# Altium project Negatoscop.PrjPcb
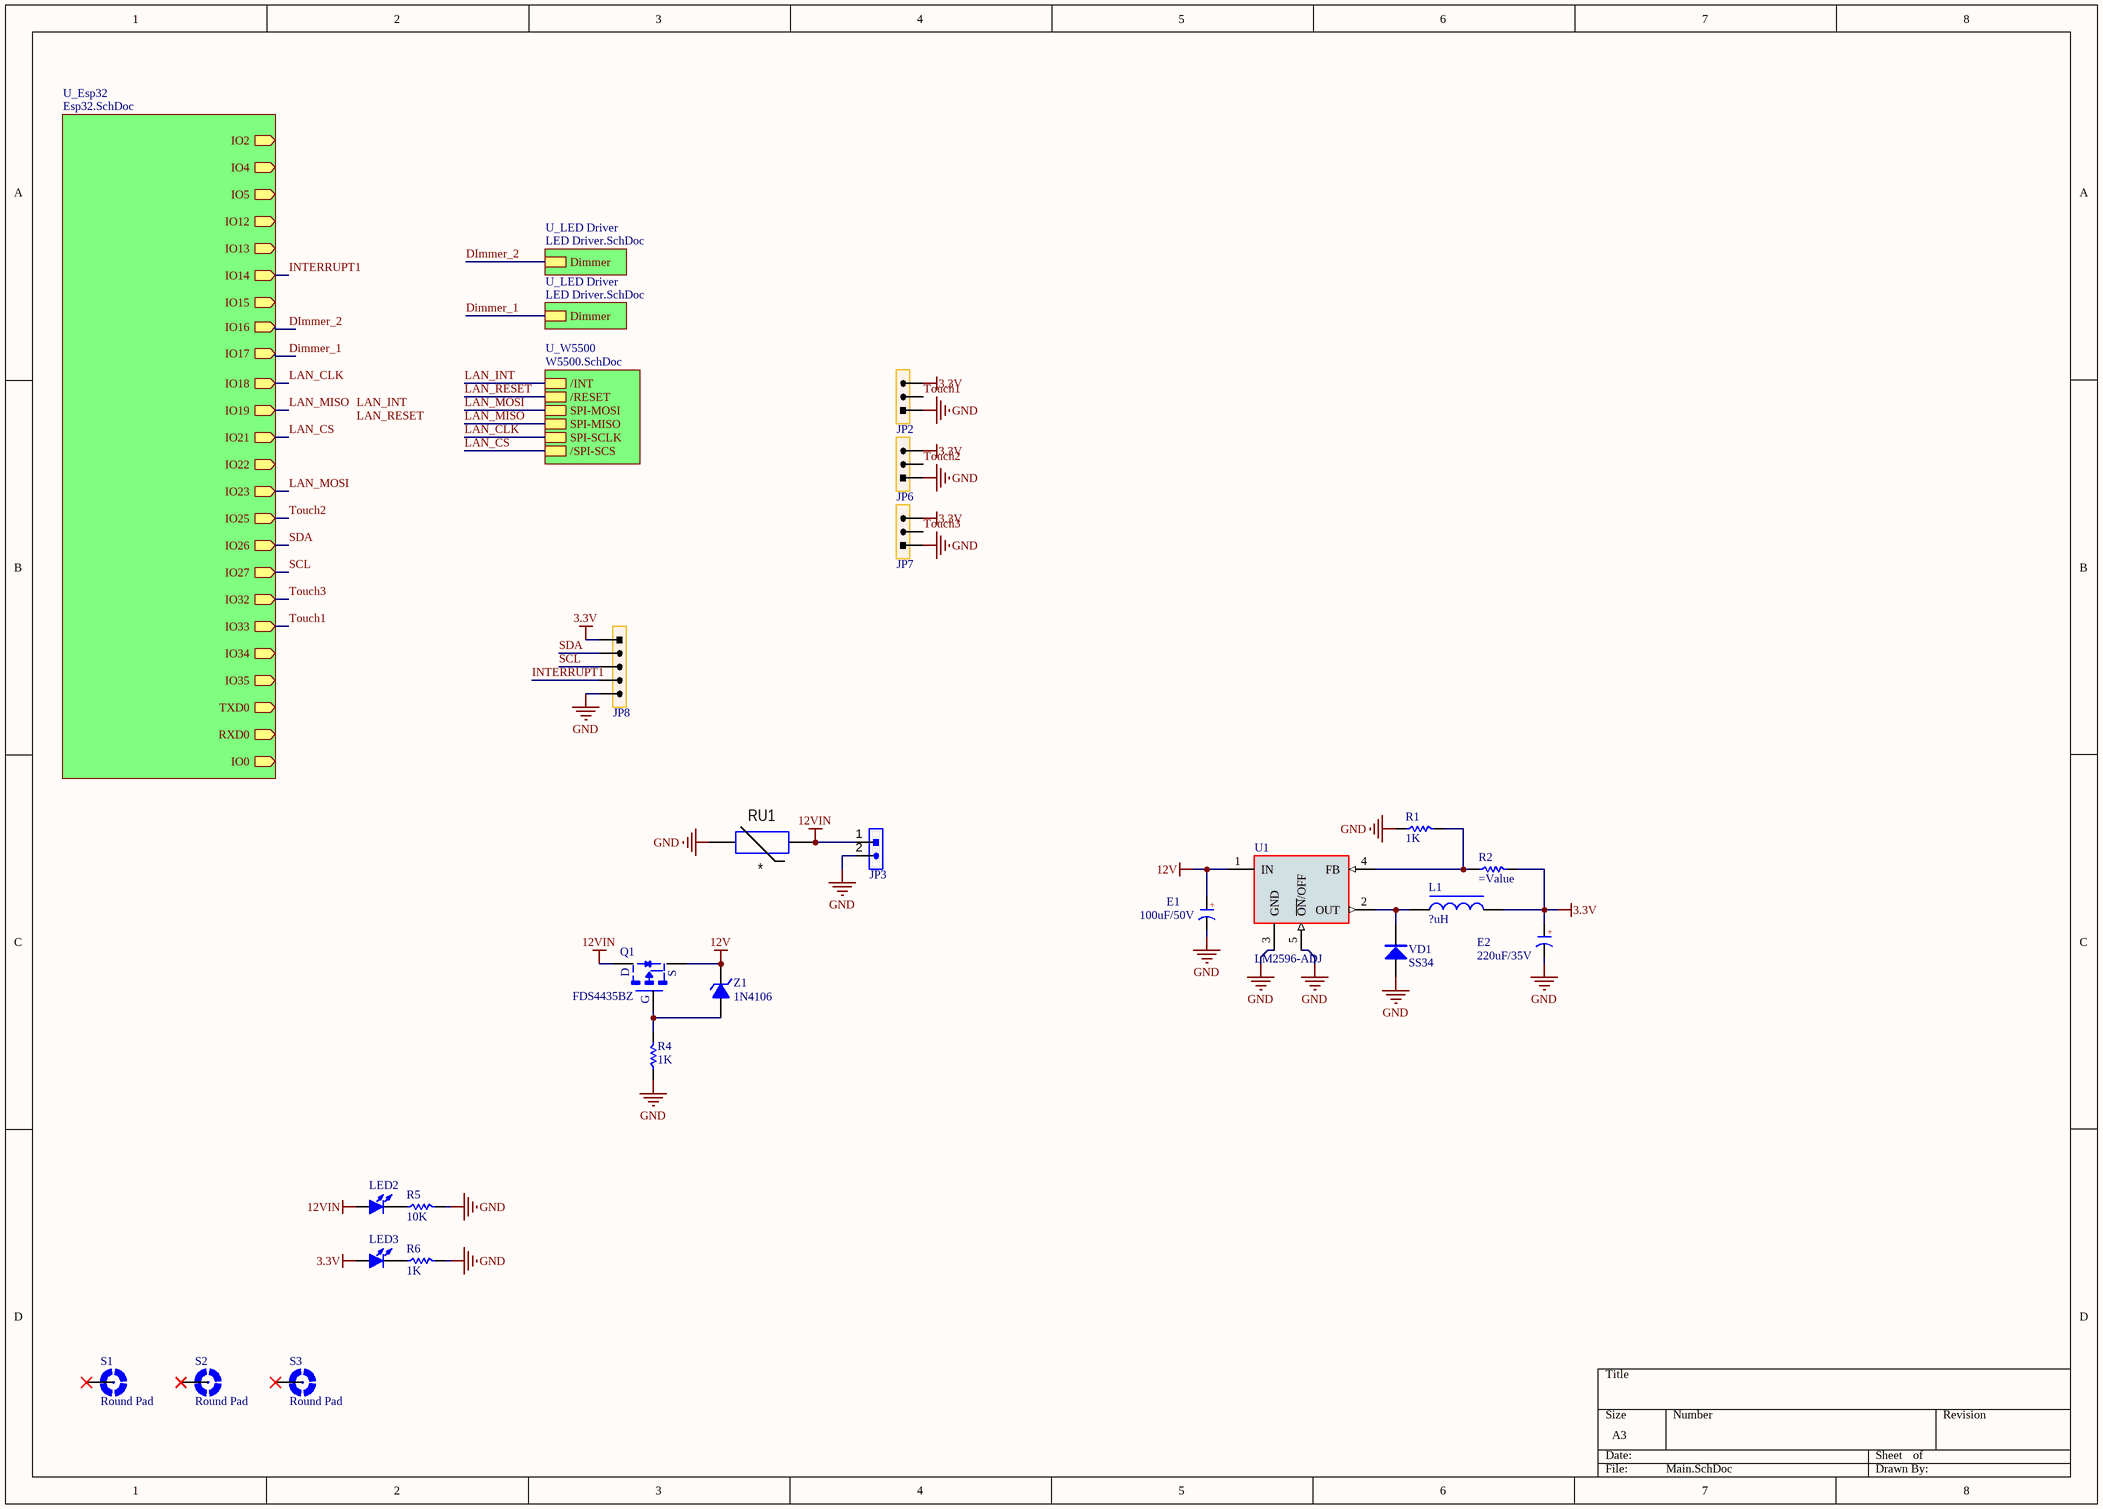
[diagram p0: Main.SchDoc]
4 sheets, 92 parts. Net scope: hierarchical (ports join the sheet entries above them; power ports are global).
Board file: Negatoscop PCB.PcbDoc
Sheets:
  Main.SchDoc
    U_Esp32 = Esp32.SchDoc
    U_LED Driver = LED Driver.SchDoc
    U_LED Driver = LED Driver.SchDoc
    U_W5500 = W5500.SchDoc

## Sheet Main.SchDoc
size A3; SheetNumber: 1; SheetTotal: 4

### Parts
(Parts that share a designator on the sheet are numbered #1, #2 ... from top to bottom, then left to right.)
E1  100uF/50V  [CM E(8*10.2)]
E2  220uF/35V  [CM E(8*10.2)]
JP2  HDR-1X3  [XH2.54-3P_H]  (value not drawn)
JP3  HDR-1X2  [KF2EDGK-2P_H_7.62]  (value not drawn)
JP6  HDR-1X3  [XH2.54-3P_H]  (value not drawn)
JP7  HDR-1X3  [XH2.54-3P_H]  (value not drawn)
JP8#1  HDR-1X5  [XH2.54-5P_H]  (value not drawn)
L1  ?uH  [CDRH125]
LED2  LED-SMD  [LED 0805R]  (value not drawn)
LED3  LED-SMD  [LED 0805R]  (value not drawn)
Q1  FDS4435BZ  [SOP8-E3]
R1  1K  [R 0805]
R2  (no value)  [R 0805]
R4  1K  [R 0805]
R5  10K  [R 0805]
R6  1K  [R 0805]
RU1  *  [Varistor Short Hieght - Straight]
S1  Round Pad  [P3.0C]  (no BOM)
S2  Round Pad  [P3.0C]  (no BOM)
S3  Round Pad  [P3.0C]  (no BOM)
U1  LM2596-ADJ  [TO263-5A]
VD1  SS34  [SMA]
Z1  1N4106  [DO-213AA]

### Sub-sheets
U_Esp32 = Esp32.SchDoc: IO2 (out), IO4 (out), IO5 (out), IO12 (out), IO13 (out), IO14 (out), IO15 (out), IO16 (out), IO17 (out), IO18 (out), IO19 (out), IO21 (out), IO22 (out), IO23 (out), IO25 (out), IO26 (out), IO27 (out), IO32 (out), IO33 (out), IO34 (out), IO35 (out), TXD0 (out), RXD0 (out), IO0 (out)
U_LED Driver = LED Driver.SchDoc: Dimmer
U_LED Driver = LED Driver.SchDoc: Dimmer
U_W5500 = W5500.SchDoc: /INT, /RESET, SPI-MOSI, SPI-MISO, SPI-SCLK, /SPI-SCS

### Nets
3.3V: E2.1(A) JP2.3 JP6.3 JP7.3 JP8#1.1 L1.2 LED3.1(A) R2.2
12V: E1.1(A) Q1.1-3(S) U1.1(IN) Z1.2(K)
12VIN: JP3.1 LED2.1(A) Q1.5-8(D) RU1.2
GND: E1.2(K) E2.2(K) JP2.1 JP3.2 JP6.1 JP7.1 JP8#1.5 R1.1 R4.1 R5.2 R6.2 RU1.1 U1.3(GND) U1.5(~{ON}/OFF) VD1.1(A)
SHIELD: S1.P S2.P S3.P
Dimmer_1: sheet U_Esp32/IO17, sheet U_LED Driver/Dimmer
DImmer_2: sheet U_Esp32/IO16, sheet U_LED Driver/Dimmer
INTERRUPT1: JP8#1.4 ; sheet U_Esp32/IO14
LAN_CLK: sheet U_Esp32/IO18, sheet U_W5500/SPI-SCLK
LAN_CS: sheet U_Esp32/IO21, sheet U_W5500//SPI-SCS
LAN_MISO: sheet U_Esp32/IO19, sheet U_W5500/SPI-MISO
LAN_MOSI: sheet U_Esp32/IO23, sheet U_W5500/SPI-MOSI
SCL: JP8#1.3 ; sheet U_Esp32/IO27
SDA: JP8#1.2 ; sheet U_Esp32/IO26
Touch1: JP2.2 ; sheet U_Esp32/IO33
Touch2: JP6.2 ; sheet U_Esp32/IO25
Touch3: JP7.2 ; sheet U_Esp32/IO32
NetL1_1: L1.1 U1.2(OUT) VD1.2(K)
NetLED2_2: LED2.2(K) R5.1
NetLED3_2: LED3.2(K) R6.1
NetQ1_4: Q1.4(G) R4.2 Z1.1(A)
NetR1_2: R1.2 R2.1 U1.4(FB)

### Notes on the sheet
- Labels drawn without touching a wire or pin: LAN_INT, LAN_RESET
- (in symbol C-CM) +

### Library data of the parts
E1 E2 = C-CM: Chip electrolytic capacitor; BOM名称: 贴片电解电容; 版权归属: 源创客; 学习资源: www.ooocke.com
JP2 JP6 JP7 = Header 3: 3P Connector; BOM名称: 3P接插件; 版权归属: 源创客; 学习资源: www.ooocke.com
JP3 = Header 2: 2P Connector; BOM名称: 2P接插件; 版权归属: 源创客; 学习资源: www.ooocke.com
JP8#1 = Header 5: 5P Connector; BOM名称: 5P接插件; 版权归属: 源创客; 学习资源: www.ooocke.com
L1 = L-CDRH: Power shielded inductor; BOM名称: 功率屏蔽电感; 版权归属: 源创客; 学习资源: www.ooocke.com
LED2 LED3 = LED-SMD: Patch LED; BOM名称: 贴片LED; 版权归属: 源创客; 学习资源: www.ooocke.com
R1 R2 R4-R6 = R: Chip resistor; 版权归属: 源创客; BOM名称: Chip resistor; 学习资源: www.ooocke.com
RU1 = V: Versiror; Manufacturer: *; Model: *; HelpURL: *; ComponentKind: *; Value: *
S1-S3 = MOUNT-PAD-ROUND: MOUNTING PAD, round
U1 = LM2596: DC step-down chip; BOM名称: DC稳压芯片; 版权归属: 源创客; 学习资源: www.ooocke.com
VD1 = SS34: Schottky diodes; BOM名称: 肖特基二极管; 版权归属: 源创客; 属性: 40V/3A; 学习资源: www.ooocke.com
Z1 = 1N4106: 12V/0.5W voltage regulator; BOM名称: 12V/0.5W稳压管; 版权归属: 源创客; 学习资源: www.ooocke.com

## Sheet Esp32.SchDoc
size A; SheetNumber: 2; SheetTotal: 4
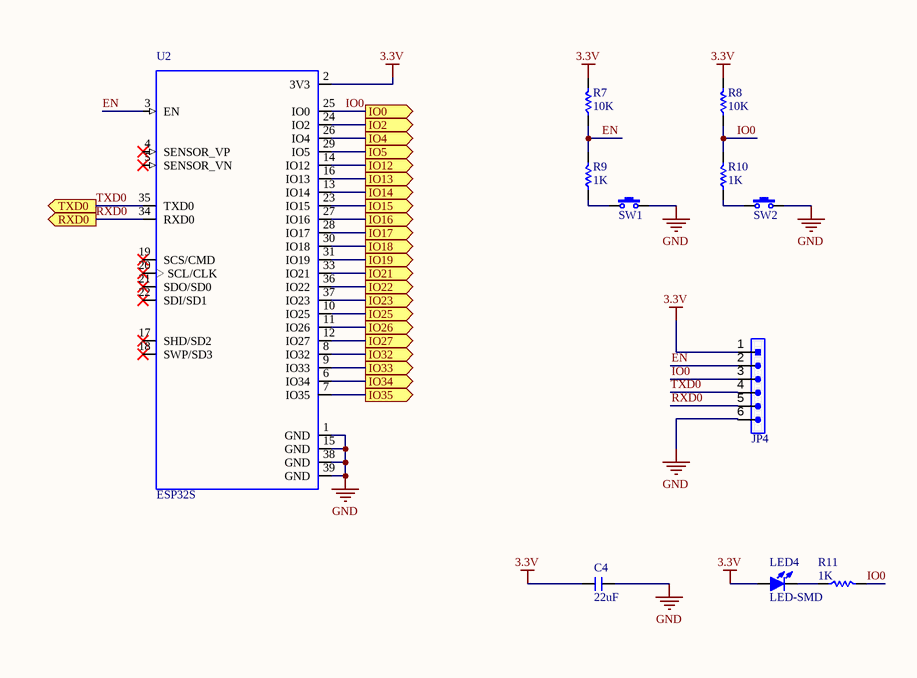
[diagram p1: Esp32.SchDoc]

### Parts
(Parts that share a designator on the sheet are numbered #1, #2 ... from top to bottom, then left to right.)
C4#1  22uF  [C 0805]
JP4  HDR-1X6  [HDR-1X6]  (value not drawn)
LED4  LED-SMD  [LED 0805B]
R7  10K  [R 0805]
R8  10K  [R 0805]
R9  1K  [R 0805]
R10  1K  [R 0805]
R11  1K  [R 0805]
SW1  3x6x5  [TSW SMD-3*6*2.5]  (value not drawn)
SW2  3x6x5  [TSW SMD-3*6*2.5]  (value not drawn)
U2  ESP32S  [ESP32S]

### Ports
IO0 (out), IO2 (out), IO4 (out), IO5 (out), IO12 (out), IO13 (out), IO14 (out), IO15 (out), IO16 (out), IO17 (out), IO18 (out), IO19 (out), IO21 (out), IO22 (out), IO23 (out), IO25 (out), IO26 (out), IO27 (out), IO32 (out), IO33 (out), IO34 (out), IO35 (out), RXD0 (out), TXD0 (out)

### Nets
3.3V: C4#1.1 JP4.1 LED4.1(A) R7.2 R8.2 U2.2(3V3)
GND: C4#1.2 JP4.6 SW1.2 SW2.2 U2.1(GND) U2.15(GND) U2.38(GND) U2.39(GND)
Dimmer_1: U2.28(IO17) ; port IO17
DImmer_2: U2.27(IO16) ; port IO16
EN: JP4.2 R7.1 R9.2 U2.3(EN)
INTERRUPT1: U2.13(IO14) ; port IO14
IO0: JP4.3 R8.1 R10.2 R11.2 U2.25(IO0) ; port IO0
LAN_CLK: U2.30(IO18) ; port IO18
LAN_CS: U2.33(IO21) ; port IO21
LAN_MISO: U2.31(IO19) ; port IO19
LAN_MOSI: U2.37(IO23) ; port IO23
RXD0: JP4.5 U2.34(RXD0) ; port RXD0
SCL: U2.12(IO27) ; port IO27
SDA: U2.11(IO26) ; port IO26
Touch1: U2.9(IO33) ; port IO33
Touch2: U2.10(IO25) ; port IO25
Touch3: U2.8(IO32) ; port IO32
TXD0: JP4.4 U2.35(TXD0) ; port TXD0
NetLED4_2: LED4.2(K) R11.1
NetR9_1: R9.1 SW1.1
NetR10_1: R10.1 SW2.1
NetU2_6: U2.6(IO34) ; port IO34
NetU2_7: U2.7(IO35) ; port IO35
NetU2_14: U2.14(IO12) ; port IO12
NetU2_16: U2.16(IO13) ; port IO13
NetU2_23: U2.23(IO15) ; port IO15
NetU2_24: U2.24(IO2) ; port IO2
NetU2_26: U2.26(IO4) ; port IO4
NetU2_29: U2.29(IO5) ; port IO5
NetU2_36: U2.36(IO22) ; port IO22

Not connected (* = marked no-connect by the designer): U2 4(SENSOR_VP)* 5(SENSOR_VN)* 17(SHD/SD2)* 18(SWP/SD3)* 19(SCS/CMD)* 20(SCL/CLK)* 21(SDO/SD0)* 22(SDI/SD1)*

### Library data of the parts
C4#1 = C: Non-polar patch capacitor; BOM名称: 无极性贴片电容; 版权归属: 源创客; 学习资源: www.ooocke.com
JP4 = Header 6: 6P Connector; BOM名称: 6P接插件; 版权归属: 源创客; 学习资源: www.ooocke.com
LED4 = LED-SMD: Patch LED; BOM名称: 贴片LED; 版权归属: 源创客; 学习资源: www.ooocke.com
R7-R11 = R: Chip resistor; 版权归属: 源创客; BOM名称: Chip resistor; 学习资源: www.ooocke.com
SW1 SW2 = TSW 3x6: 3x6 tact switch; BOM名称: 3x6轻触开关; 版权归属: 源创客; 学习资源: www.ooocke.com
U2 = ESP32S: MP: ESP32-WROOM-32D; MF: Espressif Systems; Package: Module Espressif Systems; Price: None; Availability: Unavailable; SnapEDA_Link: https://www.snapeda.com/parts/ESP32-WROOM-32D/Espressif%20Systems/view-part/?ref=snap; Value: *

## Sheet LED Driver.SchDoc
size A; SheetNumber: 4; SheetTotal: 4
Used 2 times, as channels U_LED Driver, U_LED Driver. Parts and nets are listed once, with the designators drawn on the sheet.
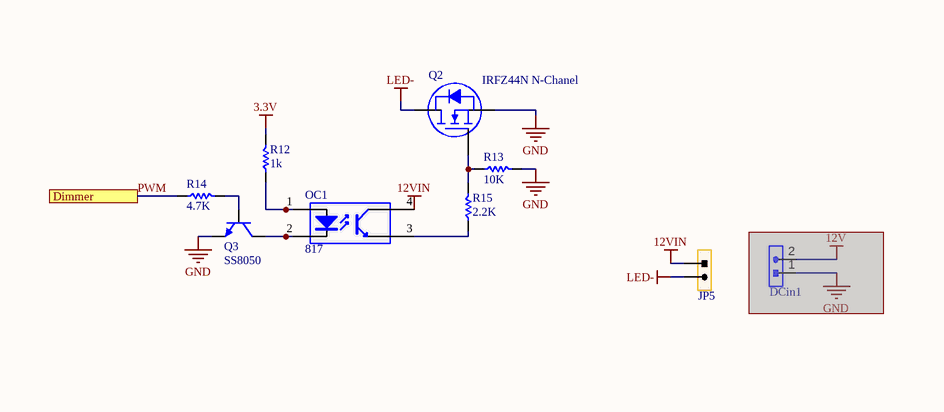
[diagram p2: LED Driver.SchDoc]

### Parts
DCin1  HDR-1X2  [KF2EDGK-2P_5.08]  (value not drawn)  (masked out: inside a compile mask, not in the netlist)
JP5  HDR-1X2  [KF381GR-2]  (value not drawn)
OC1  817  [PC817-SMD]
Q2  IRFZ44N N-Chanel  [TO263-3B]
Q3  SS8050  [SOT23-3N]
R12  1k  [R 0805]
R13  10K  [R 0805]
R14  4.7K  [R 0805]
R15  2.2K  [R 0805]

### Ports
Dimmer

### Nets
3.3V: R12.2
12VIN: JP5.1 OC1.4(C)
GND: Q2.3(S) Q3.2(E) R13.2
LED-: JP5.2 Q2.2(D)
PWM: R14.1 ; port Dimmer
NetOC1_1: OC1.1(A) R12.1
NetOC1_2: OC1.2(K) Q3.3(C)
NetOC1_3: OC1.3(E) R15.1
NetQ2_1: Q2.1(G) R13.1 R15.2
NetQ3_1: Q3.1(B) R14.2

### Channels
U_LED Driver: designators end in _U_LED_Driver#1; ports Dimmer=DImmer_2
U_LED Driver: designators end in _U_LED_Driver#2; ports Dimmer=Dimmer_1

### Library data of the parts
DCin1 JP5 = Header 2: 2P Connector; BOM名称: 2P接插件; 版权归属: 源创客; 学习资源: www.ooocke.com
OC1 = 817: AC Input Photocoupler; BOM名称: 线性光耦; 版权归属: 源创客; 学习资源: www.ooocke.com
Q2 = IRFZ44N
Q3 = 8050-SMD: High frequency amplification-NPN; BOM名称: 高频放大-NPN型; 版权归属: 源创客; 属性: 40V 1.5A 1W 100MHZ; 学习资源: www.ooocke.com
R12-R15 = R: Chip resistor; 版权归属: 源创客; BOM名称: Chip resistor; 学习资源: www.ooocke.com

## Sheet W5500.SchDoc
size A4; SheetNumber: 3; SheetTotal: 4
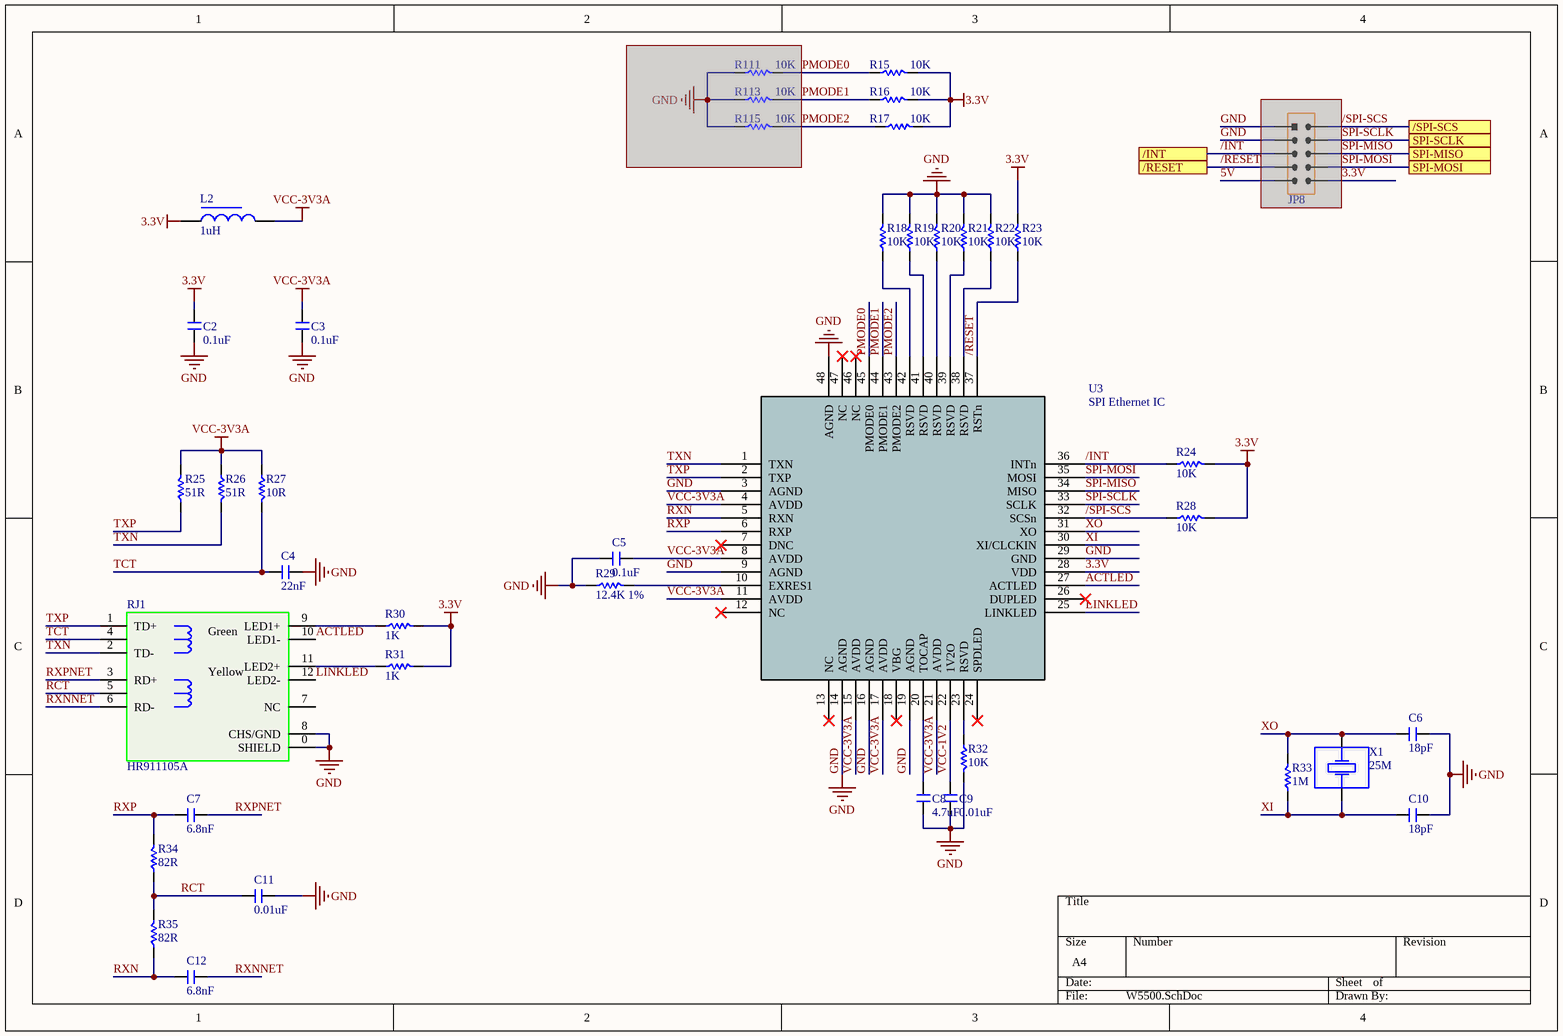
[diagram p3: W5500.SchDoc]

### Parts
(Parts that share a designator on the sheet are numbered #1, #2 ... from top to bottom, then left to right.)
C2  0.1uF  [C 0805]
C3  0.1uF  [C 0805]
C4#2  22nF  [C 0805]
C5  0.1uF  [C 0805]
C6  18pF  [C 0805]
C7  6.8nF  [C 0805]
C8  4.7uF  [C 0805]
C9  0.01uF  [C 0805]
C10  18pF  [C 0805]
C11  0.01uF  [C 0805]
C12  6.8nF  [C 0805]
JP8#2  Header 5X2  [HDR-5X2]  (value not drawn)  (masked out: inside a compile mask, not in the netlist)
L2  1uH  [L 0805]
R15  10K  [R 0805]
R16  10K  [R 0805]
R17  10K  [R 0805]
R18  10K  [R 0805]
R19  10K  [R 0805]
R20  10K  [R 0805]
R21  10K  [R 0805]
R22  10K  [R 0805]
R23  10K  [R 0805]
R24  10K  [R 0805]
R25  51R  [R 0805]
R26  51R  [R 0805]
R27  10R  [R 0805]
R28  10K  [R 0805]
R29  12.4K 1%  [R 0805]
R30  1K  [R 0805]
R31  1K  [R 0805]
R32  10K  [R 0805]
R33  1M  [R 0805]
R34  82R  [R 0805]
R35  82R  [R 0805]
R111  10K  [R 0805]  (masked out: inside a compile mask, not in the netlist)
R113  10K  [R 0805]  (masked out: inside a compile mask, not in the netlist)
R115  10K  [R 0805]  (masked out: inside a compile mask, not in the netlist)
RJ1  HR911105A  [RJ-45A12]
U3  SPI Ethernet IC  [LQFP48 7X7_L]
X1  25M  [XTAL-HC49S-THD]

### Ports
/INT, /RESET, /SPI-SCS, SPI-MISO, SPI-MOSI, SPI-SCLK

### Nets
3.3V: C2.2 L2.1 R15.2 R16.2 R17.2 R23.2 R24.2 R28.2 R30.2 R31.2 U3.28(VDD)
GND: C2.1 C3.1 C4#2.2 C5.1 C6.2 C8.2 C9.2 C10.2 C11.2 R18.2 R19.2 R20.2 R21.2 R22.2 R29.1 R32.2 RJ1.0(SHIELD) RJ1.8(CHS/GND) U3.3(AGND) U3.9(AGND) U3.14(AGND) U3.16(AGND) U3.19(AGND) U3.29(GND) U3.48(AGND)
VCC-3V3A: C3.2 C5.2 L2.2 R25.2 R26.1 R27.1 U3.4(AVDD) U3.8(AVDD) U3.11(AVDD) U3.15(AVDD) U3.17(AVDD) U3.21(AVDD)
/INT: R24.1 U3.36(INTn) ; port /INT
/RESET: R23.1 U3.37(RSTn) ; port /RESET
/SPI-SCS: R28.1 U3.32(SCSn)
ACTLED: RJ1.10(LED1-) U3.27(ACTLED)
LINKLED: RJ1.12(LED2-) U3.25(LINKLED)
PMODE0: U3.45(PMODE0)
PMODE1: U3.44(PMODE1)
PMODE2: U3.43(PMODE2)
RCT: C11.1 R34.1 R35.2 RJ1.5
RXN: C12.1 R35.1 U3.5(RXN)
RXNNET: C12.2 RJ1.6(RD-)
RXP: C7.1 R34.2 U3.6(RXP)
RXPNET: C7.2 RJ1.3(RD+)
SPI-MISO: U3.34(MISO)
SPI-MOSI: U3.35(MOSI)
SPI-SCLK: U3.33(SCLK)
TCT: C4#2.1 R27.2 RJ1.4
TXN: R26.2 RJ1.2(TD-) U3.1(TXN)
TXP: R25.1 RJ1.1(TD+) U3.2(TXP)
VCC-1V2: C9.1 U3.22(1V2O)
XI: C10.1 R33.1 U3.30(XI/CLCKIN) X1.1
XO: C6.1 R33.2 U3.31(XO) X1.2
NetC8_1: C8.1 U3.20(TOCAP)
NetR18_1: R18.1 U3.42(RSVD)
NetR19_1: R19.1 U3.41(RSVD)
NetR20_1: R20.1 U3.40(RSVD)
NetR21_1: R21.1 U3.39(RSVD)
NetR22_1: R22.1 U3.38(RSVD)
NetR29_2: R29.2 U3.10(EXRES1)
NetR30_1: R30.1 RJ1.9(LED1+)
NetR31_1: R31.1 RJ1.11(LED2+)
NetR32_1: R32.1 U3.23(RSVD)

Not connected (* = marked no-connect by the designer): R15 1; R16 1; R17 1; RJ1 7(NC); U3 7(DNC)* 12(NC)* 13(NC)* 18(VBG)* 24(SPDLED)* 26(DUPLED)* 46(NC)* 47(NC)*

### Notes on the sheet
- (in symbol HR911105A) Green; Yellow

### Library data of the parts
C2 C3 C4#2 C5-C12 = C: as C4#1 on sheet Esp32; 学习资源: www.ooocke.com
JP8#2 = Header 5X2: 5*2P Connector; BOM名称: 5*2P接插件; 版权归属: 源创客; 学习资源: www.ooocke.com
L2 = L: Low power chip inductor; BOM名称: 小功率贴片电感; 版权归属: 源创客; 学习资源: www.ooocke.com
R15-R35 R111 R113 R115 = R: Chip resistor; 版权归属: 源创客; BOM名称: Chip resistor; 学习资源: www.ooocke.com
RJ1 = HR911105A: Illuminated Ethernet interface; BOM名称: 带灯以太网接口; 版权归属: 源创客; 学习资源: www.ooocke.com
U3 = W5500
X1 = XTAL-2: 2-Pin crystal; BOM名称: 2脚晶振; 版权归属: 源创客; 学习资源: www.ooocke.com

## Nets that join several sheets
3.3V: Main (8 pins), Esp32 (6 pins), U_LED Driver (R12_U_LED_Driver#1.2), U_LED Driver (R12_U_LED_Driver#2.2), W5500 (11 pins)
12VIN: Main (JP3.1 LED2.1 Q1.5-8 RU1.2), U_LED Driver (JP5_U_LED_Driver#1.1 OC1_U_LED_Driver#1.4), U_LED Driver (JP5_U_LED_Driver#2.1 OC1_U_LED_Driver#2.4)
GND: Main (15 pins), Esp32 (8 pins), U_LED Driver (Q2_U_LED_Driver#1.3 Q3_U_LED_Driver#1.2 R13_U_LED_Driver#1.2), U_LED Driver (Q2_U_LED_Driver#2.3 Q3_U_LED_Driver#2.2 R13_U_LED_Driver#2.2), W5500 (25 pins)
LED-: U_LED Driver (JP5_U_LED_Driver#1.2 Q2_U_LED_Driver#1.2), U_LED Driver (JP5_U_LED_Driver#2.2 Q2_U_LED_Driver#2.2)
Dimmer_1: Esp32 (U2.28), U_LED Driver (R14_U_LED_Driver#2.1)
DImmer_2: Esp32 (U2.27), U_LED Driver (R14_U_LED_Driver#1.1)
INTERRUPT1: Main (JP8#1.4), Esp32 (U2.13)
SCL: Main (JP8#1.3), Esp32 (U2.12)
SDA: Main (JP8#1.2), Esp32 (U2.11)
Touch1: Main (JP2.2), Esp32 (U2.9)
Touch2: Main (JP6.2), Esp32 (U2.10)
Touch3: Main (JP7.2), Esp32 (U2.8)